# Altium schematic sheet eth_100base-tx_rtl8152b.SchDoc
size A
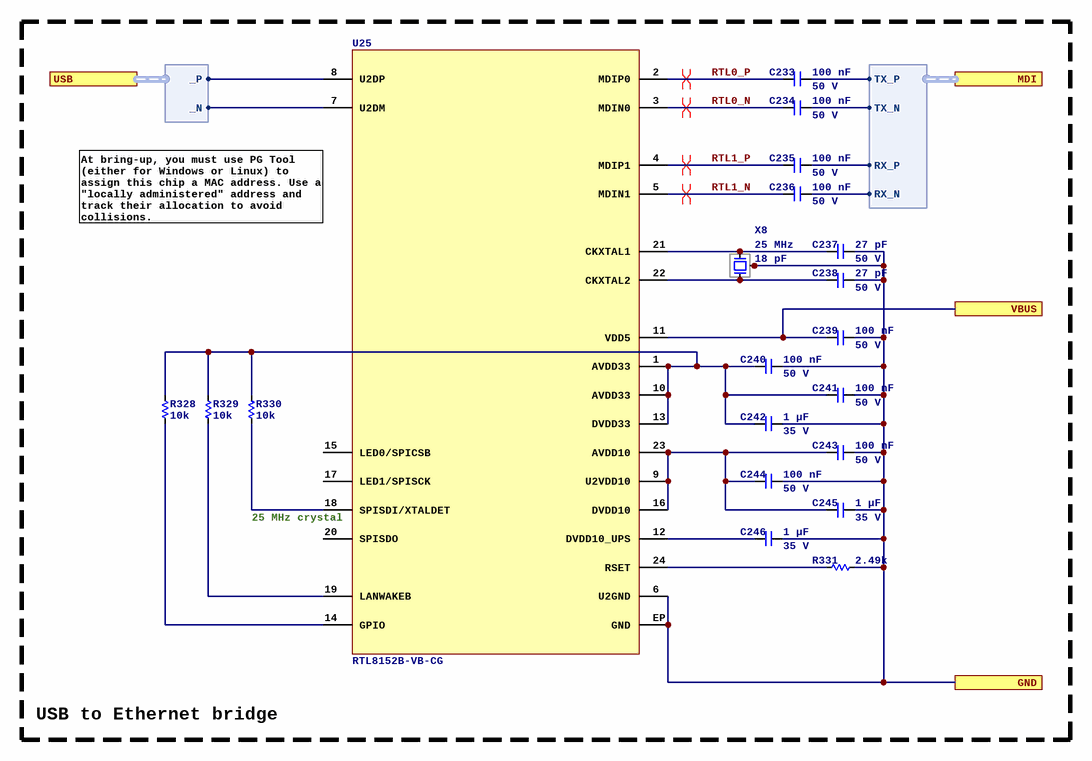
[diagram p0: eth_100base-tx_rtl8152b.SchDoc]

## Parts
C233  Capacitance: 100 nF  Voltage Rating: 50 V  [C0402]  (hidden comment: CL05B104KB54PNC)
C234  Capacitance: 100 nF  Voltage Rating: 50 V  [C0402]  (hidden comment: CL05B104KB54PNC)
C235  Capacitance: 100 nF  Voltage Rating: 50 V  [C0402]  (hidden comment: CL05B104KB54PNC)
C236  Capacitance: 100 nF  Voltage Rating: 50 V  [C0402]  (hidden comment: CL05B104KB54PNC)
C237  Capacitance: 27 pF  Voltage Rating: 50 V  [C0402]  (hidden comment: CC0402JRNPO9BN270)
C238  Capacitance: 27 pF  Voltage Rating: 50 V  [C0402]  (hidden comment: CC0402JRNPO9BN270)
C239  Capacitance: 100 nF  Voltage Rating: 50 V  [C0402]  (hidden comment: CL05B104KB54PNC)
C240  Capacitance: 100 nF  Voltage Rating: 50 V  [C0402]  (hidden comment: CL05B104KB54PNC)
C241  Capacitance: 100 nF  Voltage Rating: 50 V  [C0402]  (hidden comment: CL05B104KB54PNC)
C242  Capacitance: 1 µF  Voltage Rating: 35 V  [C0603]  (hidden comment: GMK107AB7105KAHT)
C243  Capacitance: 100 nF  Voltage Rating: 50 V  [C0402]  (hidden comment: CL05B104KB54PNC)
C244  Capacitance: 100 nF  Voltage Rating: 50 V  [C0402]  (hidden comment: CL05B104KB54PNC)
C245  Capacitance: 1 µF  Voltage Rating: 35 V  [C0603]  (hidden comment: GMK107AB7105KAHT)
C246  Capacitance: 1 µF  Voltage Rating: 35 V  [C0603]  (hidden comment: GMK107AB7105KAHT)
R328  value 10k  [R0402]  (hidden comment: 0402WGF1002TCE)
R329  value 10k  [R0402]  (hidden comment: 0402WGF1002TCE)
R330  value 10k  [R0402]  (hidden comment: 0402WGF1002TCE)
R331  value 2.49k  [R0402]  (hidden comment: 0402WGF2491TCE)
U25  RTL8152B-VB-CG  [24QFN4E]
X8  Frequency: 25 MHz  Capacitance: 18 pF  [4_SMD_3.2X2.5MM]  (hidden comment: ECS-250-18-33-JGN-TR3)

## Ports
GND, MDI (harness 100BASE-TX), USB (harness DIFF), VBUS

## Harnesses
DIFF: _N, _P
100BASE-TX: TX_N, TX_P, RX_N, RX_P

## Nets
GND: C237.2 C238.2 C239.1 C240.1 C241.1 C242.2 C243.1 C244.1 C245.2 C246.2 R331.1 U25.6(U2GND) U25.EP(GND) X8.2 X8.4 ; port GND
RTL0_N: C234.2 U25.3(MDIN0)
RTL0_P: C233.2 U25.2(MDIP0)
RTL1_N: C236.2 U25.5(MDIN1)
RTL1_P: C235.2 U25.4(MDIP1)
VBUS: C239.2 U25.11(VDD5) ; port VBUS
NetC233_1: C233.1 ; port MDI.TX_P
NetC234_1: C234.1 ; port MDI.TX_N
NetC235_1: C235.1 ; port MDI.RX_P
NetC236_1: C236.1 ; port MDI.RX_N
NetC237_1: C237.1 U25.21(CKXTAL1) X8.3
NetC238_1: C238.1 U25.22(CKXTAL2) X8.1
NetC240_2: C240.2 C241.2 C242.1 R328.1 R329.1 R330.1 U25.1(AVDD33) U25.10(AVDD33) U25.13(DVDD33)
NetC243_2: C243.2 C244.2 C245.1 U25.9(U2VDD10) U25.16(DVDD10) U25.23(AVDD10)
NetC246_1: C246.1 U25.12(DVDD10_UPS)
NetR328_2: R328.2 U25.14(GPIO)
NetR329_2: R329.2 U25.19(LANWAKEB)
NetR330_2: R330.2 U25.18(SPISDI/XTALDET)
NetR331_2: R331.2 U25.24(RSET)
NetU25_7: U25.7(U2DM) ; port USB._N
NetU25_8: U25.8(U2DP) ; port USB._P

Not connected (* = marked no-connect by the designer): U25 15(LED0/SPICSB) 17(LED1/SPISCK) 20(SPISDO)

## Layout directives
differential pair; differential pair class DE_100: RTL0_N, RTL0_P, RTL1_N, RTL1_P

## Notes on the sheet
- (near U25) At bring-up, you must use PG Tool (either for Windows or Linux) to assign this chip a MAC address. Use a "locally administered" address and track their allocation to avoid collisions.
- (near U25) 25 MHz crystal
- USB to Ethernet bridge

## Library data of the parts
C233-C236 C239-C241 C243 C244 = CL05B104KB54PNC: Manufacturer: Samsung Electro-Mechanics; Dielectric: X7R; ComponentLink1URL: https://wmsc.lcsc.com/wmsc/upload/file/pdf/v2/lcsc/2304140030_Samsung-Electro-Mechanics-CL05B104KB54PNC_C307331.pdf; ComponentLink1Description: Datasheet; Manufacturer Part Number: CL05B104KB54PNC; Package: 0402; Supplier 2: LCSC; Supplier Part Number 2: C307331
C237 C238 = CC0402JRNPO9BN270: Manufacturer: YAGEO; Dielectric: NP0; ComponentLink1URL: https://wmsc.lcsc.com/wmsc/upload/file/pdf/v2/lcsc/2304140030_YAGEO-CC0402JRNPO9BN270_C107002.pdf; ComponentLink1Description: Datasheet; Manufacturer Part Number: CC0402JRNPO9BN270; Package: 0402; Supplier 2: LCSC; Supplier Part Number 2: C107002
C242 C245 C246 = GMK107AB7105KAHT: Manufacturer: Taiyo Yuden; Dielectric: X7R; ComponentLink1URL: https://datasheet.lcsc.com/lcsc/2304140030_Taiyo-Yuden-GMK107AB7105KAHT_C841050.pdf; ComponentLink1Description: Datasheet; Manufacturer Part Number: GMK107AB7105KAHT; Package: 0603; Supplier 2: LCSC; Supplier Part Number 2: C841050
R328-R330 = 0402WGF1002TCE: Manufacturer: UNI-ROYAL(Uniroyal Elec); Tolerance: 1%; Temperature Coefficient: ±100ppm/?; Power Rating (mW): 62.5; ComponentLink1Description: Datasheet; ComponentLink1URL: https://wmsc.lcsc.com/wmsc/upload/file/pdf/v2/lcsc/2206010100_UNI-ROYAL-Uniroyal-Elec-0402WGF1002TCE_C25744.pdf; Manufacturer Part Number: 0402WGF1002TCE; Package: 0402; Supplier 2: LCSC; Supplier Part Number 2: C25744
R331 = 0402WGF2491TCE: Manufacturer: UNI-ROYAL(Uniroyal Elec); Tolerance: 1%; Temperature Coefficient: ±100ppm/?; Power Rating (mW): 62.5; ComponentLink1Description: Datasheet; ComponentLink1URL: https://wmsc.lcsc.com/wmsc/upload/file/pdf/v2/lcsc/2206010045_UNI-ROYAL-Uniroyal-Elec-0402WGF2491TCE_C25884.pdf; Manufacturer Part Number: 0402WGF2491TCE; Package: 0402; Supplier 2: LCSC; Supplier Part Number 2: C25884
U25 = RTL8152B-VB-CG: Integrated 10/100M Ethernet Controller for USB Applications; Manufacturer: REALTEK; Manufacturer Part Number: RTL8152B-VB-CG; ComponentLink1Description: Datasheet; ComponentLink1URL: https://www1.futureelectronics.com/doc/Realtek/Realtek-Semicon-RTL8152B-VB-CG_C50656.pdf; Supplier 2: LCSC; Supplier Part Number 2: C50656
X8 = ECS-250-18-33-JGN-TR3: 25 MHz ±20ppm Crystal 18pF 40 Ohms 4-SMD, No Lead; Manufacturer: ECS Inc.; Supplier 1: DigiKey; Manufacturer Part Number: ECS-250-18-33-JGN-TR3; Supplier Part Number 1: 50-ECS-250-18-33-JGN-TR3CT-ND; Supplier 2: LCSC; Supplier Part Number 2: C5354421; ComponentLink1Description: Datasheet; ComponentLink1URL: https://ecsxtal.com/store/pdf/ecx-32.pdf; Supplier 3: Mouser; Supplier Part Number 3: 520-250-18-33JGN-TR3